# Altium schematic sheet Shett_3.SchDoc
size A3
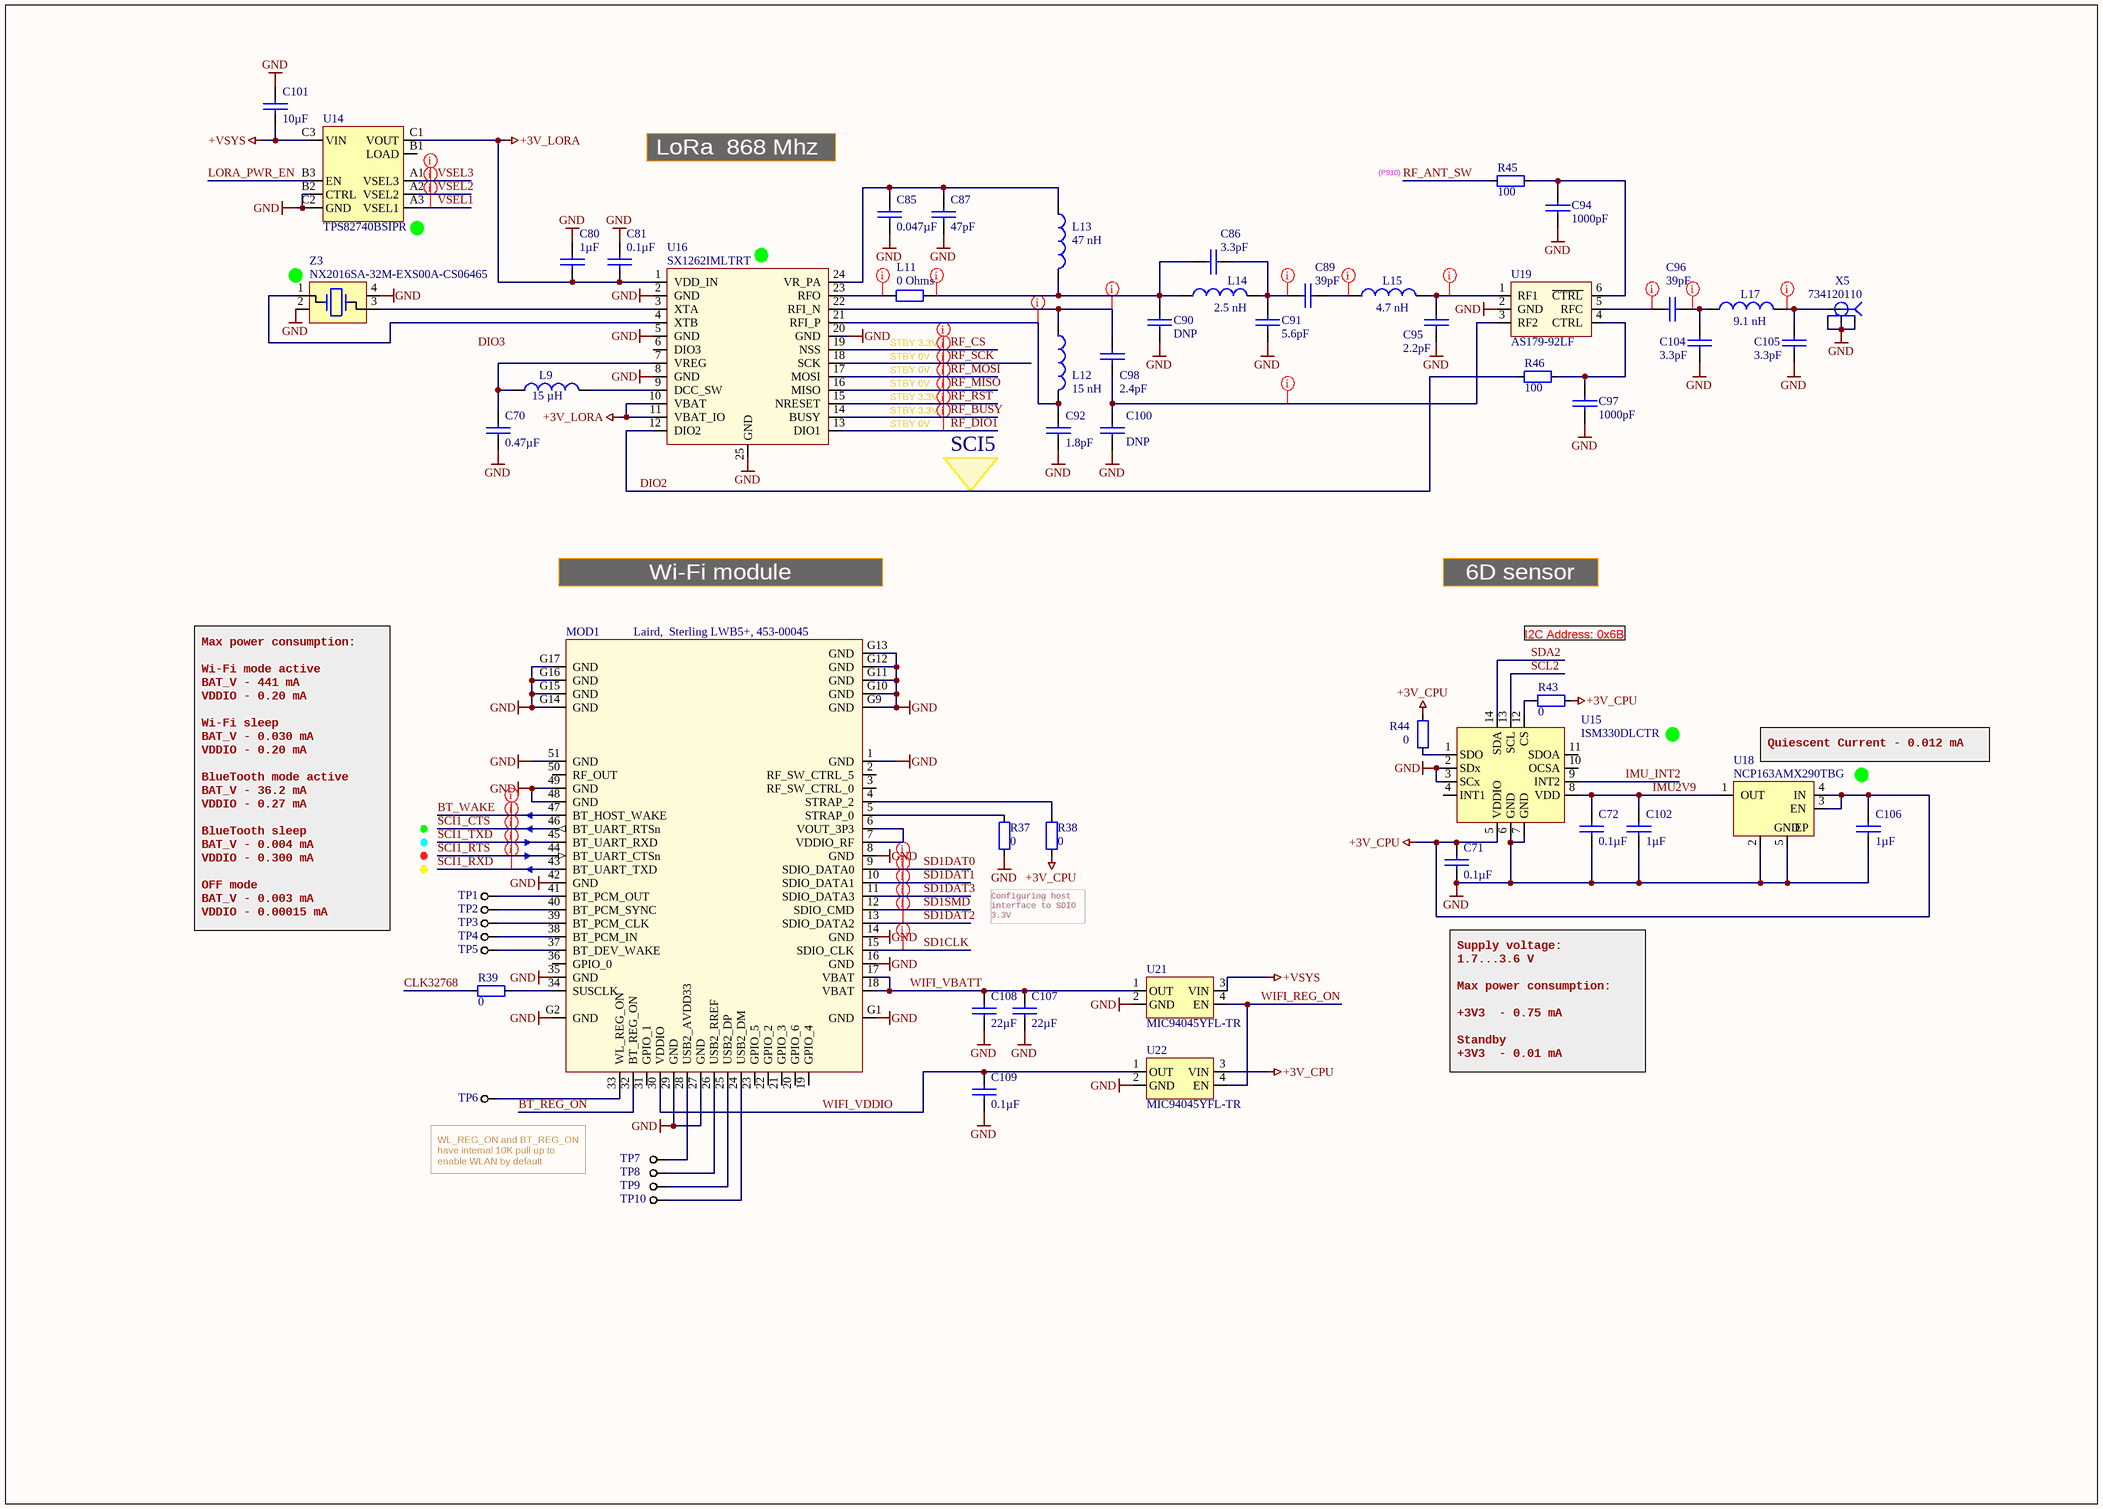
[diagram p0: Shett_3.SchDoc]

## Parts
C70  value 0.47µF  [0402 CAP]  (hidden comment: GRT155R61E474ME01D)
C71  value 0.1µF  [0402 CAP]  (hidden comment: 0402B104K500CT)
C72  value 0.1µF  [0402 CAP]  (hidden comment: 0402B104K500CT)
C80  value 1µF  [0402 CAP]  (hidden comment: TMK105BJ105MV-F)
C81  value 0.1µF  [0402 CAP]  (hidden comment: 0402B104K500CT)
C85  value 0.047µF  [0402 CAP]  (hidden comment: CC0402KRX7R8BB473)
C86  value 3.3pF  [0402 CAP]  (hidden comment: 885392005011)
C87  value 47pF  [0402 CAP]  (hidden comment: GJM1555C1H470FB01D)
C89  value 39pF  [0402 CAP]  (hidden comment: GJM1555C1H390JB01D)
C90  value DNP  [0402 CAP]  (hidden comment: Capacitor_0402)  (no BOM)
C91  value 5.6pF  [0402 CAP]  (hidden comment: GJM1555C1H5R6BB01D)
C92  value 1.8pF  [0402 CAP]  (hidden comment: GJM1555C1H1R8BB01D)
C94  value 1000pF  [0402 CAP]  (hidden comment: C1005CH1H102J050BA)
C95  value 2.2pF  [0402 CAP]  (hidden comment: CBR04C229B5GAC)
C96  value 39pF  [0402 CAP]  (hidden comment: GJM1555C1H390JB01D)
C97  value 1000pF  [0402 CAP]  (hidden comment: C1005CH1H102J050BA)
C98  value 2.4pF  [0402 CAP]  (hidden comment: GJM1555C1H2R4BB01D)
C100  value DNP  [0402 CAP]  (hidden comment: Capacitor_0402)  (no BOM)
C101  value 10µF  [0603 CAP]  (hidden comment: GRT188R61C106KE13D)
C102  value 1µF  [0402 CAP]  (hidden comment: TMK105BJ105MV-F)
C104  value 3.3pF  [0402 CAP]  (hidden comment: 885392005011)
C105  value 3.3pF  [0402 CAP]  (hidden comment: 885392005011)
C106  value 1µF  [0402 CAP]  (hidden comment: TMK105BJ105MV-F)
C107  value 22µF  [0603 CAP]  (hidden comment: LMK107BBJ226MA-T)
C108  value 22µF  [0603 CAP]  (hidden comment: LMK107BBJ226MA-T)
C109  value 0.1µF  [0402 CAP]  (hidden comment: 0402B104K500CT)
L9  value 15 µH  [2012[0805]]  (hidden comment: LQM21DH150M70L)
L11  value 0 Ohms  [INDC1005-0402]  (hidden comment: CRCW04020000Z0ED)
L12  value 15 nH  [INDC1005-0402]  (hidden comment: LQW15AN15NH00D)
L13  value 47 nH  [INDC1005-0402]  (hidden comment: LQW15AN47NJ00D)
L14  value 2.5 nH  [INDC1005-0402]  (hidden comment: LQW15AN2N5C00D)
L15  value 4.7 nH  [INDC1005-0402]  (hidden comment: LQW15AN4N7C00D)
L17  value 9.1 nH  [INDC1005-0402]  (hidden comment: LQW15AN9N1H00D)
MOD1  Laird,  Sterling LWB5+, 453-00045  [LWB5+ 453-00045C ver S7V30]
R37  value 0  [0402]  (hidden comment: WR04X000 PTL)
R38  value 0  [0402]  (hidden comment: WR04X000 PTL)
R39  value 0  [0402]  (hidden comment: WR04X000 PTL)
R43  value 0  [0402]  (hidden comment: WR04X000 PTL)
R44  value 0  [0402]  (hidden comment: WR04X000 PTL)
R45  value 100  [0402]  (hidden comment: RMCF0402FT100R)
R46  value 100  [0402]  (hidden comment: RMCF0402FT100R)
TP1  Test_point 0.5 мм  [Test point 0.5 мм]  (value not drawn)  (net tie, no BOM)
TP2  Test_point 0.5 мм  [Test point 0.5 мм]  (value not drawn)  (net tie, no BOM)
TP3  Test_point 0.5 мм  [Test point 0.5 мм]  (value not drawn)  (net tie, no BOM)
TP4  Test_point 0.5 мм  [Test point 0.5 мм]  (value not drawn)  (net tie, no BOM)
TP5  Test_point 0.5 мм  [Test point 0.5 мм]  (value not drawn)  (net tie, no BOM)
TP6  Test_point 0.5 мм  [Test point 0.5 мм]  (value not drawn)  (net tie, no BOM)
TP7  Test_point 0.5 мм  [Test point 0.5 мм]  (value not drawn)  (net tie, no BOM)
TP8  Test_point 0.5 мм  [Test point 0.5 мм]  (value not drawn)  (net tie, no BOM)
TP9  Test_point 0.5 мм  [Test point 0.5 мм]  (value not drawn)  (net tie, no BOM)
TP10  Test_point 0.5 мм  [Test point 0.5 мм]  (value not drawn)  (net tie, no BOM)
U14  TPS82740BSIPR  [MicroSiP]
U15  ISM330DLCTR  [LGA-14 BOSCH]
U16  SX1262IMLTRT  [VQFN24]
U18  NCP163AMX290TBG  [4-XDFN]
U19  AS179-92LF  [SC70-6]
U21  MIC94045YFL-TR  [4-WDFN]
U22  MIC94045YFL-TR  [4-WDFN]
X5  734120110  [0734120110]
Z3  NX2016SA-32M-EXS00A-CS06465  [4-SMD 2.00mm x 1.60mm]

## Nets
+3V_CPU: C71.1 C106.1 R38.1 R43.1 R44.2 U15.5(VDDIO) U18.3(EN) U18.4(IN) U22.3(VIN)
+3V_LORA: C80.2 C81.2 U14.C1(VOUT) U16.1(VDD_IN) U16.10(VBAT) U16.11(VBAT_IO)
+VSYS: C101.2 U14.C3(VIN) U21.3(VIN)
GND: C70.2 C71.2 C72.2 C80.1 C81.1 C85.2 C87.2 C90.2 C91.2 C92.2 C94.1 C95.2 C97.1 C100.2 C101.1 C102.2 C104.1 C105.1 C106.2 C107.2 C108.2 C109.2 MOD1.1(GND) MOD1.8(GND) MOD1.14(GND) MOD1.16(GND) MOD1.27(GND) MOD1.29(GND) MOD1.35(GND) MOD1.42(GND) MOD1.48(GND) MOD1.49(GND) MOD1.51(GND) MOD1.G1(GND) MOD1.G2(GND) MOD1.G9(GND) MOD1.G10(GND) MOD1.G11(GND) MOD1.G12(GND) MOD1.G13(GND) MOD1.G14(GND) MOD1.G15(GND) MOD1.G16(GND) MOD1.G17(GND) R37.1 U14.B2(CTRL) U14.C2(GND) U15.2(SDx) U15.3(SCx) U15.6(GND) U15.7(GND) U16.2(GND) U16.5(GND) U16.8(GND) U16.20(GND) U16.25(GND) U18.2(GND) U18.5(EP) U19.2(GND) U21.2(GND) U22.2(GND) X5.2 X5.3 X5.4 Z3.2 Z3.4
BT_REG_ON: MOD1.32(BT_REG_ON)
BT_WAKE: MOD1.47(BT_HOST_WAKE)
CLK32768: R39.2
DIO2: R46.2 U16.12(DIO2)
IMU2V9: C72.1 C102.1 U15.8(VDD) U18.1(OUT)
IMU_INT2: U15.9(INT2)
LORA_PWR_EN: U14.B3(EN)
RF_ANT_SW: R45.2
RF_BUSY: U16.14(BUSY)
RF_CS: U16.19(NSS)
RF_DIO1: U16.13(DIO1)
RF_MISO: U16.16(MISO)
RF_MOSI: U16.17(MOSI)
RF_RST: U16.15(NRESET)
RF_SCK: U16.18(SCK)
SCI1_CTS: MOD1.46(BT_UART_RTSn)
SCI1_RTS: MOD1.44(BT_UART_CTSn)
SCI1_RXD: MOD1.43(BT_UART_TXD)
SCI1_TXD: MOD1.45(BT_UART_RXD)
SCL2: U15.13(SCL)
SD1CLK: MOD1.15(SDIO_CLK)
SD1DAT0: MOD1.9(SDIO_DATA0)
SD1DAT1: MOD1.10(SDIO_DATA1)
SD1DAT2: MOD1.13(SDIO_DATA2)
SD1DAT3: MOD1.11(SDIO_DATA3)
SD1SMD: MOD1.12(SDIO_CMD)
SDA2: U15.14(SDA)
VSEL1: U14.A3(VSEL1)
VSEL2: U14.A2(VSEL2)
VSEL3: U14.A1(VSEL3)
WIFI_REG_ON: U21.4(EN) U22.4(EN)
WIFI_VBATT: C107.1 C108.1 MOD1.17(VBAT) MOD1.18(VBAT) U21.1(OUT)
WIFI_VDDIO: C109.1 MOD1.30(VDDIO) U22.1(OUT)
NetC70_1: C70.1 L9.1 U16.7(VREG)
NetC85_1: C85.1 C87.1 L13.1 U16.24(VR_PA)
NetC86_1: C86.1 C90.1 L11.2 L13.2 L14.1
NetC86_2: C86.2 C89.1 C91.1 L14.2
NetC89_2: C89.2 L15.1
NetC92_1: C92.1 L12.2 U16.21(RFI_P)
NetC94_2: C94.2 R45.1 U19.6(~{CTRL})
NetC95_1: C95.1 L15.2 U19.1(RF1)
NetC96_1: C96.1 U19.5(RFC)
NetC96_2: C96.2 C104.2 L17.1
NetC97_2: C97.2 R46.1 U19.4(CTRL)
NetC98_1: C98.1 L12.1 U16.22(RFI_N)
NetC98_2: C98.2 C100.1 U19.3(RF2)
NetC105_2: C105.2 L17.2 X5.1(Sig)
NetL9_2: L9.2 U16.9(DCC_SW)
NetL11_1: L11.1 U16.23(RFO)
NetMOD1_4: MOD1.4(STRAP_2) R38.2
NetMOD1_5: MOD1.5(STRAP_0) R37.2
NetMOD1_6: MOD1.6(VOUT_3P3) MOD1.7(VDDIO_RF)
NetMOD1_24: MOD1.24(USB2_DM) TP10.1
NetMOD1_25: MOD1.25(USB2_DP) TP9.1
NetMOD1_26: MOD1.26(USB2_RREF) TP8.1
NetMOD1_28: MOD1.28(USB2_AVDD33) TP7.1
NetMOD1_33: MOD1.33(WL_REG_ON) TP6.1
NetMOD1_34: MOD1.34(SUSCLK) R39.1
NetMOD1_37: MOD1.37(BT_DEV_WAKE) TP5.1
NetMOD1_38: MOD1.38(BT_PCM_IN) TP4.1
NetMOD1_39: MOD1.39(BT_PCM_CLK) TP3.1
NetMOD1_40: MOD1.40(BT_PCM_SYNC) TP2.1
NetMOD1_41: MOD1.41(BT_PCM_OUT) TP1.1
NetR43_2: R43.2 U15.12(CS)
NetR44_1: R44.1 U15.1(SDO)
NetU16_3: U16.3(XTA) Z3.3
NetU16_4: U16.4(XTB) Z3.1

Not connected (* = marked no-connect by the designer): MOD1 2(RF_SW_CTRL_5) 3(RF_SW_CTRL_0) 19(GPIO_4) 20(GPIO_6) 21(GPIO_3) 22(GPIO_2) 23(GPIO_5) 31(GPIO_1) 36(GPIO_0) 50(RF_OUT); U14 B1(LOAD); U15 4(INT1) 10(OCSA) 11(SDOA); U16 6(DIO3)

## Layout directives
net class RF: NetC86_1, NetC86_2, NetC89_2, NetC92_1, NetC95_1, NetC96_1, NetC96_2, NetC98_1, NetC98_2, NetC105_2, NetL11_1
net class VSEL: VSEL1, VSEL2, VSEL3
net class LoRa: RF_BUSY, RF_CS, RF_DIO1, RF_MISO, RF_MOSI, RF_RST, RF_SCK
net class SDIO: SD1CLK, SD1DAT0, SD1DAT1, SD1DAT2, SD1DAT3, SD1SMD
net class CSI1: BT_WAKE, SCI1_CTS, SCI1_RTS, SCI1_RXD, SCI1_TXD

## Notes on the sheet
- LoRa  868 Mhz
- (P910)
- STBY 0V
- STBY 3.3V
- SCI5
- Wi-Fi module
- 6D sensor
- I2C Address: 0x6B
- (near U18) Quiescent Current - 0.012 mA
- Configuring host interface to SDIO 3.3V
- Max power consumption:
  Wi-Fi mode active
  BAT_V - 441 mA
  VDDIO - 0.20 mA
  Wi-Fi sleep
  BAT_V - 0.030 mA
  VDDIO - 0.20 mA
  BlueTooth mode active
  BAT_V - 36.2 mA
  VDDIO - 0.27 mA
  BlueTooth sleep
  BAT_V - 0.004 mA
  VDDIO - 0.300 mA
  OFF mode
  BAT_V - 0.003 mA
  VDDIO - 0.00015 mA
- Supply voltage:
  1.7...3.6 V
  Max power consumption:
  +3V3  - 0.75 mA
  Standby
  +3V3  - 0.01 mA
- (near TP6) WL_REG_ON and BT_REG_ON have internal 10K pull-up to enable WLAN by default
- Labels drawn without touching a wire or pin: DIO3

## Library data of the parts
C70 = GRT155R61E474ME01D: 0.47µF, ±20%, 25V, X5R, 0402 (1005 Metric), -55°C ~ 85°C, -, Automotive; Manufacturer: Murata Electronics North America; PartNum: 490-12270-1-ND; Voltage - Rated: 25V; Part Number: GRT155R61E474ME01D; Distributor: Digi-Key; PartName: GRT155R61E474ME01D; Price: 0.13000; Tolerance: ±20%; Temperature Coefficient: X5R; Operating Temperature: -55°C ~ 85°C; Features: -; Package / Case: 0402 (1005 Metric)
C71 C72 C81 C109 = 0402B104K500CT: 0.1µF, ±10%, 50V, X7R, 0402 (1005 Metric), -55°C ~ 125°C, -, General Purpose; Manufacturer: Walsin Technology Corporation; PartNum: 1292-1176-1-ND; Voltage - Rated: 50V; Part Number: 0402B104K500CT; Distributor: Digi-Key; PartName: 0402B104K500CT; Price: 0.19000; Tolerance: ±10%; Temperature Coefficient: X7R; Operating Temperature: -55°C ~ 125°C; Features: -; Package / Case: 0402 (1005 Metric)
C80 C102 C106 = TMK105BJ105MV-F: 1µF, ±20%, 25V, X5R, 0402 (1005 Metric), -55°C ~ 85°C, -, General Purpose; Manufacturer: Taiyo Yuden; PartNum: 587-3245-1-ND; Voltage - Rated: 25V; Part Number: TMK105BJ105MV-F; Distributor: Digi-Key; PartName: TMK105BJ105MV-F; Price: 0.22000; Tolerance: ±20%; Temperature Coefficient: X5R; Operating Temperature: -55°C ~ 85°C; Features: -; Package / Case: 0402 (1005 Metric)
C85 = CC0402KRX7R8BB473: 0.047µF, ±10%, 25V, X7R, 0402 (1005 Metric), -55°C ~ 125°C, -, General Purpose; Manufacturer: Yageo; PartNum: 311-1717-1-ND; Voltage - Rated: 25V; Part Number: CC0402KRX7R8BB473; Distributor: Digi-Key; PartName: CC0402KRX7R8BB473; Price: 0.10000; Tolerance: ±10%; Temperature Coefficient: X7R; Operating Temperature: -55°C ~ 125°C; Features: -; Package / Case: 0402 (1005 Metric)
C86 C104 C105 = 885392005011: 3.3pF, ±0.1pF, 50V, C0G, NP0, 0402 (1005 Metric), -55°C ~ 125°C, -, RF, Microwave, High Frequency; Manufacturer: Wurth Electronics Inc.; PartNum: 732-13236-1-ND; Voltage - Rated: 50V; Part Number: 885392005011; Distributor: Digi-Key; PartName: 885392005011; Price: 0.10000; Tolerance: ±0.1pF; Temperature Coefficient: C0G, NP0; Operating Temperature: -55°C ~ 125°C; Features: -; Package / Case: 0402 (1005 Metric)
C87 = GJM1555C1H470FB01D: 47pF, ±1%, 50V, C0G, NP0, 0402 (1005 Metric), -55°C ~ 125°C, High Q, Low Loss, RF, Microwave, High Frequency; Manufacturer: Murata Electronics North America; PartNum: 490-16376-1-ND; Voltage - Rated: 50V; Part Number: GJM1555C1H470FB01D; Distributor: Digi-Key; PartName: GJM1555C1H470FB01D; Price: 0.28000; Tolerance: ±1%; Temperature Coefficient: C0G, NP0; Operating Temperature: -55°C ~ 125°C; Features: High Q, Low Loss; Package / Case: 0402 (1005 Metric)
C89 C96 = GJM1555C1H390JB01D: 39pF, ±5%, 50V, C0G, NP0, 0402 (1005 Metric), -55°C ~ 125°C, High Q, Low Loss, RF, Microwave, High Frequency; Manufacturer: Murata Electronics North America; PartNum: 490-17673-1-ND; Voltage - Rated: 50V; Part Number: GJM1555C1H390JB01D; Distributor: Digi-Key; PartName: GJM1555C1H390JB01D; Price: 0.24000; Tolerance: ±5%; Temperature Coefficient: C0G, NP0; Operating Temperature: -55°C ~ 125°C; Features: High Q, Low Loss; Package / Case: 0402 (1005 Metric)
C91 = GJM1555C1H5R6BB01D: 5.6pF, ±0.1pF, 50V, C0G, NP0, 0402 (1005 Metric), -55°C ~ 125°C, High Q, Low Loss, RF, Microwave, High Frequency; Manufacturer: Murata Electronics North America; PartNum: 490-11225-1-ND; Voltage - Rated: 50V; Part Number: GJM1555C1H5R6BB01D; Distributor: Digi-Key; PartName: GJM1555C1H5R6BB01D; Price: 0.19000; Tolerance: ±0.1pF; Temperature Coefficient: C0G, NP0; Operating Temperature: -55°C ~ 125°C; Features: High Q, Low Loss; Package / Case: 0402 (1005 Metric)
C92 = GJM1555C1H1R8BB01D: 1.8pF, ±0.1pF, 50V, C0G, NP0, 0402 (1005 Metric), -55°C ~ 125°C, High Q, Low Loss, RF, Microwave, High Frequency; Manufacturer: Murata Electronics North America; PartNum: 490-8089-1-ND; Voltage - Rated: 50V; Part Number: GJM1555C1H1R8BB01D; Distributor: Digi-Key; PartName: GJM1555C1H1R8BB01D; Price: 0.19000; Tolerance: ±0.1pF; Temperature Coefficient: C0G, NP0; Operating Temperature: -55°C ~ 125°C; Features: High Q, Low Loss; Package / Case: 0402 (1005 Metric)
C94 C97 = C1005CH1H102J050BA: 1000pF, ±5%, 50V, CH, 0402 (1005 Metric), -25°C ~ 85°C, Low ESL, General Purpose; Manufacturer: TDK Corporation; PartNum: 445-10829-1-ND; Voltage - Rated: 50V; Part Number: C1005CH1H102J050BA; Distributor: Digi-Key; PartName: C1005CH1H102J050BA; Price: 0.19000; Tolerance: ±5%; Temperature Coefficient: CH; Operating Temperature: -25°C ~ 85°C; Features: Low ESL; Package / Case: 0402 (1005 Metric)
C95 = CBR04C229B5GAC: 2.2pF, ±0.1pF, 50V, C0G, NP0, 0402 (1005 Metric), -55°C ~ 125°C, High Q, Low Loss, RF, Microwave, High Frequency; Manufacturer: KEMET; PartNum: 399-17527-1-ND; Voltage - Rated: 50V; Part Number: CBR04C229B5GAC; Distributor: Digi-Key; PartName: CBR04C229B5GAC; Price: 0.19000; Tolerance: ±0.1pF; Temperature Coefficient: C0G, NP0; Operating Temperature: -55°C ~ 125°C; Features: High Q, Low Loss; Package / Case: 0402 (1005 Metric)
C98 = GJM1555C1H2R4BB01D: 2.4pF, ±0.1pF, 50V, C0G, NP0, 0402 (1005 Metric), -55°C ~ 125°C, High Q, Low Loss, RF, Microwave, High Frequency; Manufacturer: Murata Electronics North America; PartNum: 490-8093-1-ND; Voltage - Rated: 50V; Part Number: GJM1555C1H2R4BB01D; Distributor: Digi-Key; PartName: GJM1555C1H2R4BB01D; Price: 0.19000; Tolerance: ±0.1pF; Temperature Coefficient: C0G, NP0; Operating Temperature: -55°C ~ 125°C; Features: High Q, Low Loss; Package / Case: 0402 (1005 Metric)
C101 = GRT188R61C106KE13D: 10µF, ±10%, 16V, X5R, 0603 (1608 Metric), -55°C ~ 85°C, -, Automotive; Manufacturer: Murata Electronics North America; PartNum: 490-12317-1-ND; Voltage - Rated: 16V; Part Number: GRT188R61C106KE13D; Distributor: Digi-Key; PartName: GRT188R61C106KE13D; Price: 0.22770; Tolerance: ±10%; Temperature Coefficient: X5R; Operating Temperature: -55°C ~ 85°C; Features: -; Package / Case: 0603 (1608 Metric)
C107 C108 = LMK107BBJ226MA-T: 22µF, ±20%, 10V, X5R, 0603 (1608 Metric), -55°C ~ 85°C, -, SMPS Filtering; Manufacturer: Taiyo Yuden; PartNum: 587-4913-1-ND; Part Number: LMK107BBJ226MA-T; Distributor: Digi-Key; PartName: LMK107BBJ226MA-T; Price: 0.25810; Tolerance: ±20%; Voltage - Rated: 10V; Temperature Coefficient: X5R; Operating Temperature: -55°C ~ 85°C; Features: -; Package / Case: 0603 (1608 Metric)
L9 = LQM21DH150M70L: 15 µH Shielded Multilayer Inductor 250 mA, 1.235Ohm, 24MHz Max 0805 (2012 Metric); Manufacturer: Murata Electronics; PartNum: 490-LQM21DH150M70LCT-ND; Tolerance: ±20%; Distributor: Digi-Key; Price: 0.16$; PartName: LQM21DH150M70L
L11 = CRCW04020000Z0ED: 0 Ohms Jumper 0.063W, 1/16W Chip Resistor 0402 (1005 Metric) Automotive AEC-Q200 Thick Film; Manufacturer: Vishay Dale; PartNum: 541-0.0JCT-ND; Distributor: Digi-Key; PartName: CRCW04020000Z0ED
L12 = LQW15AN15NH00D: 15nH Unshielded Wirewound Inductor 460mA 160 mOhm Max 0402 (1006 Metric); Manufacturer: Murata; PartNum: 490-6772-1-ND; Tolerance: ±3%; Distributor: Digi-Key; PartName: LQW15AN15NH00D
L13 = LQW15AN47NJ00D: 47nH Unshielded Wirewound Inductor 210mA 1.08 Ohm Max 0402 (1005 Metric); Manufacturer: Murata; PartNum: 490-1154-1-ND; Tolerance: ±5%; Distributor: Digi-Key; PartName: LQW15AN47NJ00D
L14 = LQW15AN2N5C00D: 2.5nH Unshielded Wirewound Inductor 850mA 50 mOhm Max 0402 (1006 Metric); Manufacturer: Murata; PartNum: 490-6798-1-ND; Tolerance: ±0.2nH; Distributor: Digi-Key; PartName: LQW15AN2N5C00D
L15 = LQW15AN4N7C00D: 4.7nH Unshielded Wirewound Inductor 750mA 70 mOhm Max 0402 (1006 Metric); Manufacturer: Murata Electronics North America; PartNum: 490-1139-1-ND; Tolerance: ±0.2nH; Distributor: Digi-Key; PartName: LQW15AN4N7C00D
L17 = LQW15AN9N1H00D: 9.1nH Unshielded Wirewound Inductor 540mA 140 mOhm Max 0402 (1006 Metric); Manufacturer: Murata Electronics North America; PartNum: 490-8444-1-ND; Tolerance: ±3%; Distributor: Digi-Key; PartName: LQW15AN9N1H00D
MOD1 = CMP-MOD-453-00012-1.4_ver_S7V30: Module, Sterling LWB5+; Substitutes Allowed: NO; Footprint: Laird, Sterling LWB5+ Module, Platform Size; Mounting: SMT; Operating Temperature: -40°C ~ +85°C; Manufacturer: Laird
R37-R39 R43 R44 = WR04X000 PTL: 0 Ohms Jumper 0.063W, 1/16W Chip Resistor 0402 (1005 Metric) Thick Film; Manufacturer: Walsin Technology Corporation; PartNum: 1292-WR04X000PTLCT-ND; Voltage: 50 V; Distributor: Digi-Key; Price: 0.002$; PartName: WR04X000 PTL
R45 R46 = RMCF0402FT100R: 100 Ohms, ±1%, 0.063W, 1/16W, Thick Film, ±100ppm/°C, 0402 (1005 Metric), -55°C ~ 155°C, Automotive AEC-Q200; Manufacturer: Stackpole Electronics Inc; PartNum: RMCF0402FT100RCT-ND; Voltage: 75V; Distributor: Digi-Key; Price: 0.10000; Tolerance: ±1%; PartName: RMCF0402FT100R; Part Number: RMCF0402FT100R; Temperature Coefficient: ±100ppm/°C; Operating Temperature: -55°C ~ 155°C; Power (Watts): 0.063W, 1/16W; Features: Automotive AEC-Q200; Package / Case: 0402 (1005 Metric)
U14 = TPS82740BSIPR: Non-Isolated PoL Module DC DC Converter 1 Output 2.6 ~ 3.3V 200mA 2.2V - 5.5V Input, 3.0mm x 2.4mm x 1.0mm, -40...85 C; Manufacturer: Texas Instruments; PartNum: 296-46481-1-ND; Distributor: Digi-Key; price: 2.88$; PartName: TPS82740BSIPR
U15 = ISM330DLCTR: Accelerometer, Gyroscope, Temperature, 3 Axis Sensor I²C, SPI , -40°C ~ 85°C, 14-LGA (2.5x3); Manufacturer: STMicroelectronics; PartNum: 497-17583-1-ND; Price: 6.28$; Distributor: Digi-Key; PartName: ISM330DLCTR
U16 = SX1262IMLTRT: IC RF TxRx Only General ISM < 1GHz LoRaWAN 150MHz ~ 960MHz 24-VFQFN Exposed Pad; Manufacturer: Semtech Corporation; PartName: SX1262IMLTRTCT-ND; Distributor: Digi-Key; PartNum: SX1262IMLTRT; Price: 7.94$
U18 = NCP163AMX290TBG: LDO 2.9V, 250 mA, Vin < 5.5V, Iq < 20uA, PSSR 91dB ~ 60dB, -40..+125 C,  4-XDFN (1x1); Manufacturer: ON Semiconductor; PartNum: NCP163AMX290TBGOSCT-ND; Price: 0.41$; Distributor: Digi-Key; PartName: NCP163AMX290TBG
U19 = AS179-92LF: RF Switch IC 802.11b, g, Bluetooth, WLAN SPDT 3 GHz 50Ohm SC-70-6, -40°C ~ 85°C; Manufacturer: Skyworks Solutions Inc.; PartNum: 863-1003-1-ND; Distributor: Digi-Key; PartName: AS179-92LF
U21 U22 = MIC94045YFL-TR: Power Switch P-Channel, 1.7V ~ 5.5V, 3A, 28 mOhm,   4-MLF® (1.2x1.2), -40...125 C; Manufacturer: Microchip Technology; PartNum: 576-3973-1-ND; Distributor: Digi-Key; price: 067$; PartName: MIC94045YFL-TR
X5 = 0734120110: U.FL (UMCC) Connector Receptacle, Male Pin 50 Ohm Surface Mount Solder; Manufacturer: Molex; PartNum: WM5587TR-ND; Distributor: Digi-Key; PartName: 0734120110
Z3 = NX2016SA-32M-EXS00A-CS06465: 32 MHz Crystal 10pF,  60 Ohms, 10 ppm,  4-SMD, No Lead, -40...+85 С; Manufacturer: NDK America, Inc.; PartNum: 644-1300-1-ND; Tolerance: ±1ppm; Value: 32 MHz; Distributor: Digi-Key; Price: 0.38$; PartName: NX2016SA-32M-EXS00A-CS06465